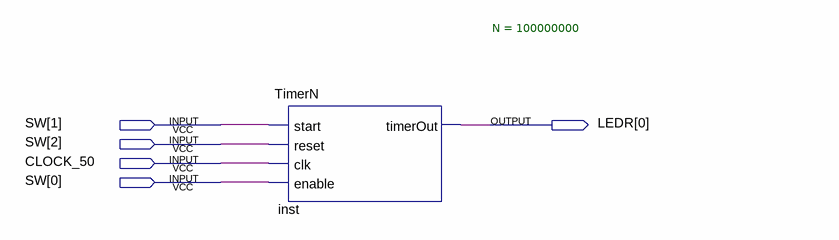
[diagram p0: schematic sheet]
// Quartus schematic TimerN_VHDL.bdf as structural Verilog: 1 symbols, 5 pins
module TimerN_VHDL (
  input  [2:0] SW,
  input  CLOCK_50,
  output [0:0] LEDR
);

  TimerN #(.N(100000000)) inst (.start(SW[1]), .reset(SW[2]), .clk(CLOCK_50), .enable(SW[0]), .timerOut(LEDR[0]));
endmodule
